# Altium schematic sheet revision.SchDoc
size A4
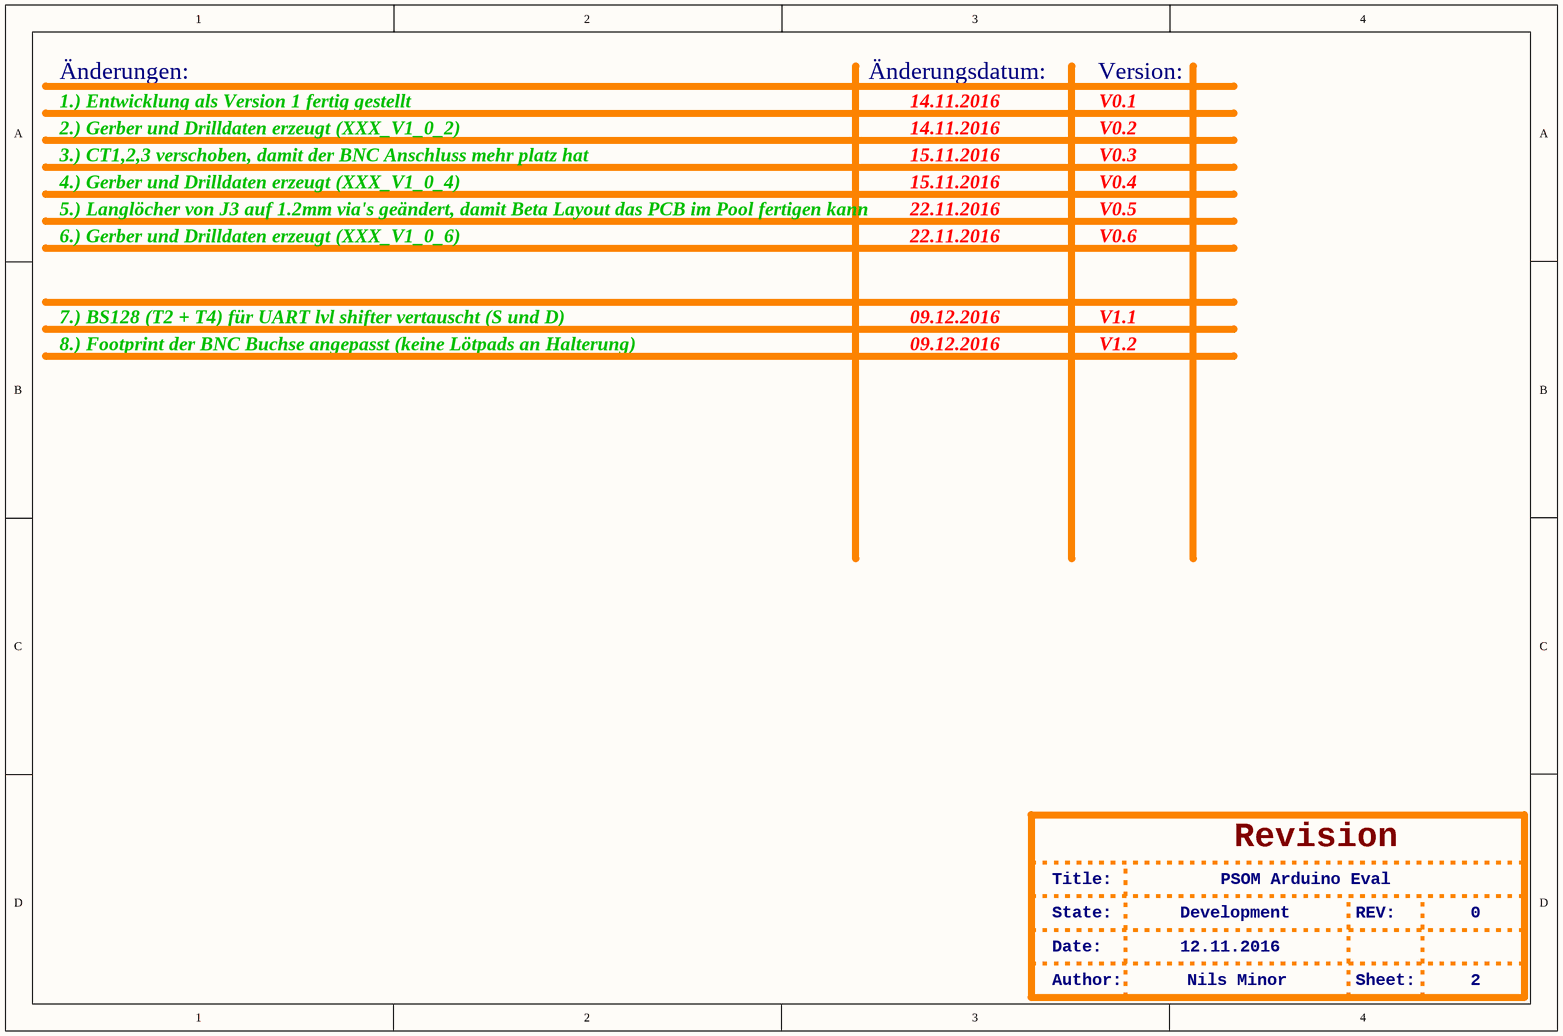
[diagram p0: revision.SchDoc]

## Notes on the sheet
- Änderungen:
- 1.) Entwicklung als Version 1 fertig gestellt
- Änderungsdatum:
- 14.11.2016
- Version:
- V0.1
- 2.) Gerber und Drilldaten erzeugt (XXX_V1_0_2)
- 3.) CT1,2,3 verschoben, damit der BNC Anschluss mehr platz hat
- 15.11.2016
- V0.2
- V0.3
- 4.) Gerber und Drilldaten erzeugt (XXX_V1_0_4)
- 6.) Gerber und Drilldaten erzeugt (XXX_V1_0_6)
- 5.) Langlöcher von J3 auf 1.2mm via's geändert, damit Beta Layout das PCB im Pool fertigen kann
- 22.11.2016
- V0.4
- V0.6
- V0.5
- 7.) BS128 (T2 + T4) für UART lvl shifter vertauscht (S und D)
- 8.) Footprint der BNC Buchse angepasst (keine Lötpads an Halterung)
- 09.12.2016
- V1.1
- V1.2
- Revision
- Title:
- State:
- Development
- PSOM Arduino Eval
- REV:
- 0
- Date:
- Author:
- 12.11.2016
- Nils Minor
- Sheet:
- 2